# EAGLE design touch_7 (EAGLE 9.6.2)
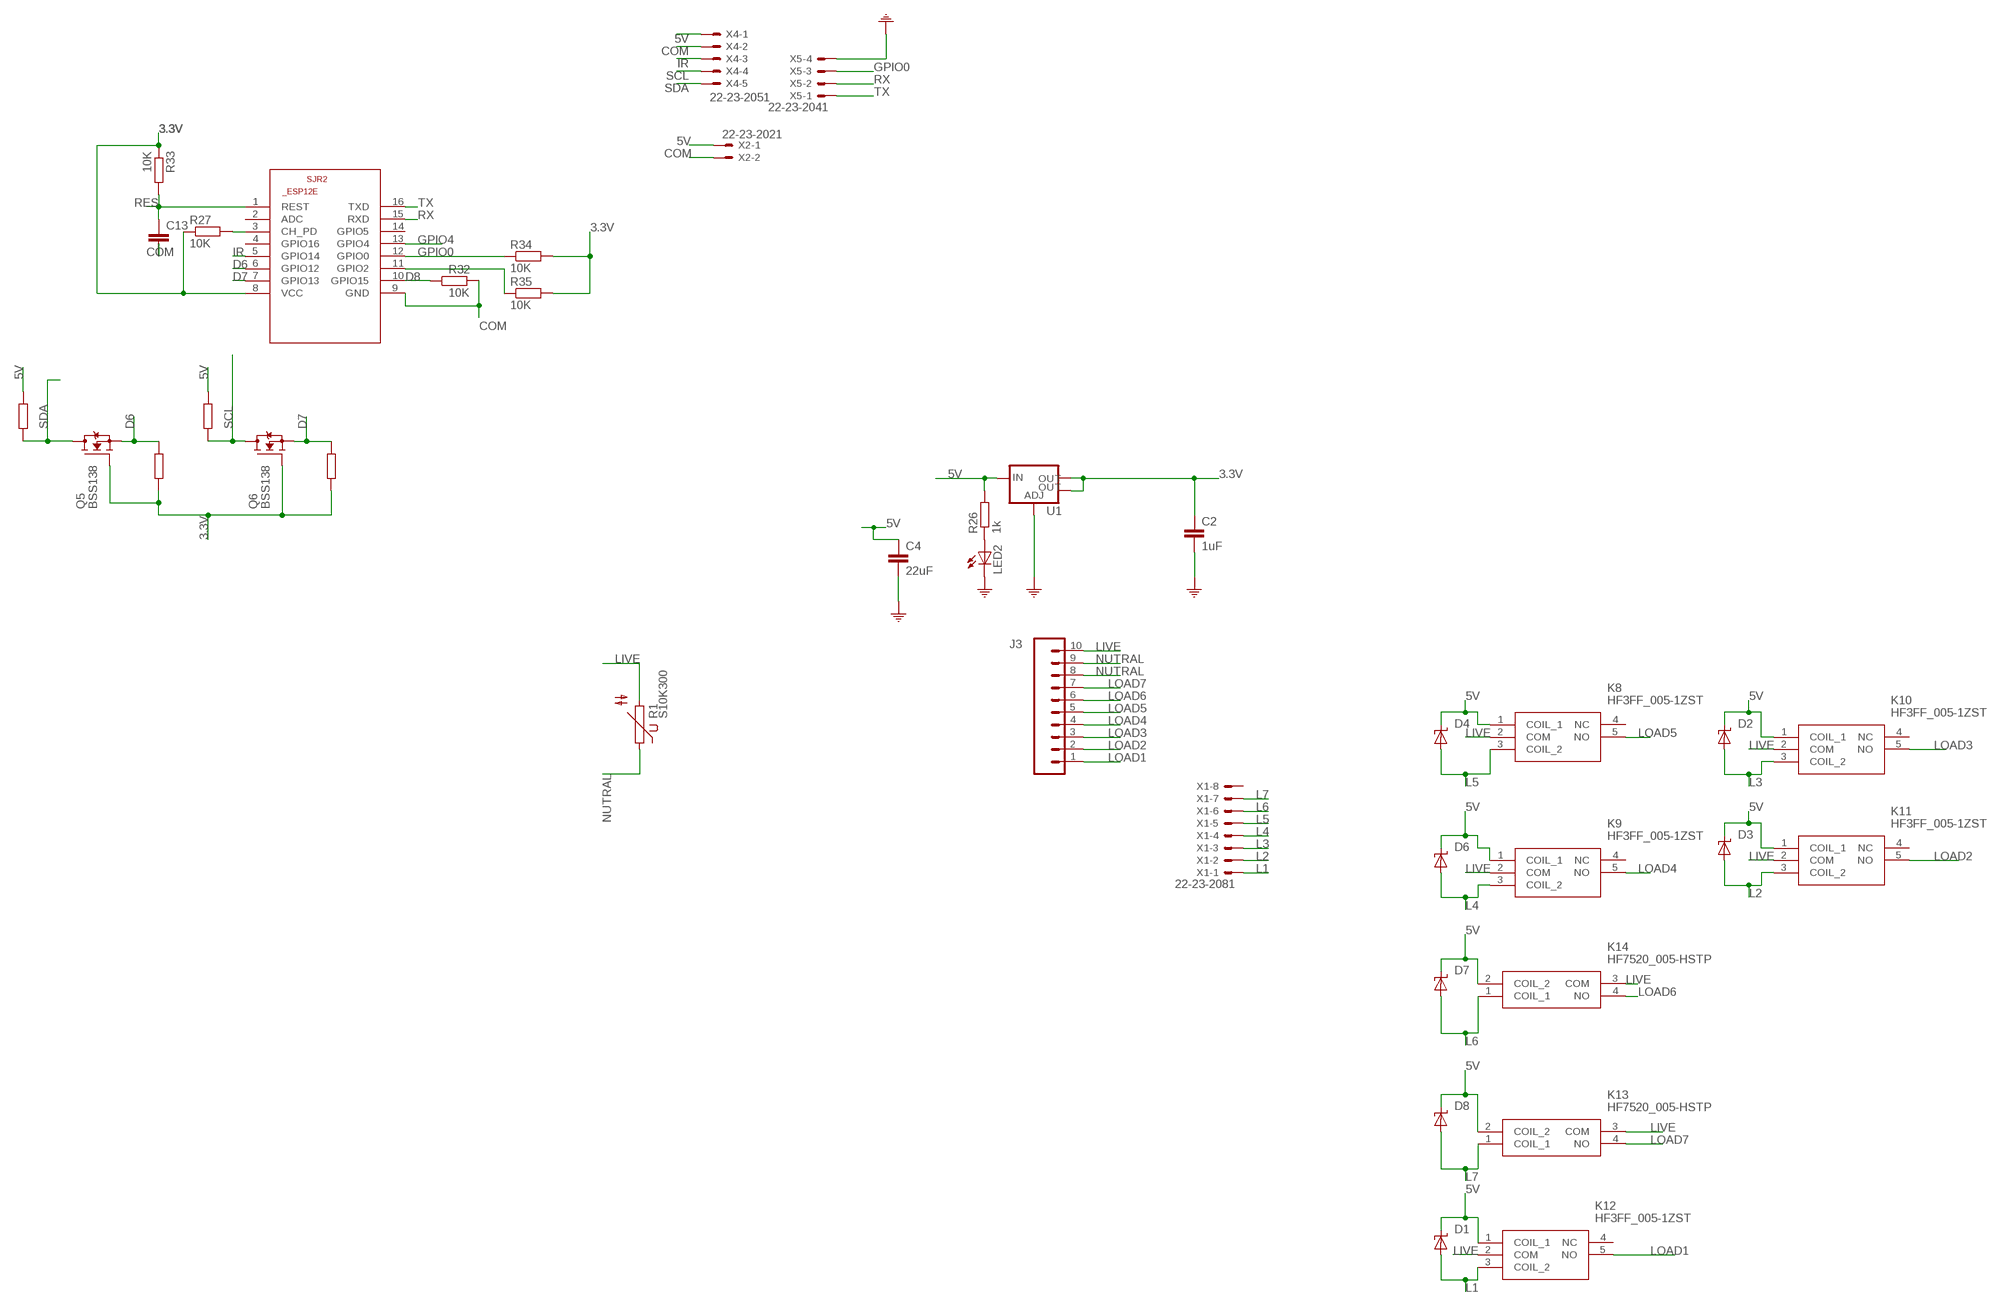
[diagram p0: schematic, sheet 1]

## Parts
C2  1uF  C-EUC1206  [C1206]
C4  22uF  C-EUC1206  [C1206]
C13  C-EUC0805  [C0805]
D1  SUPPRESSOR-SMBJ  [SMBJ]
D2  SUPPRESSOR-SMBJ  [SMBJ]
D3  SUPPRESSOR-SMBJ  [SMBJ]
D4  SUPPRESSOR-SMBJ  [SMBJ]
D6  SUPPRESSOR-SMBJ  [SMBJ]
D7  SUPPRESSOR-SMBJ  [SMBJ]
D8  SUPPRESSOR-SMBJ  [SMBJ]
J3  CONN_083.5MM-8  [SCREWTERMINAL-3.5MM-8]
K8  HF3FF_005-1ZST  [HF3FF0051ZST]
K9  HF3FF_005-1ZST  [HF3FF0051ZST]
K10  HF3FF_005-1ZST  [HF3FF0051ZST]
K11  HF3FF_005-1ZST  [HF3FF0051ZST]
K12  HF3FF_005-1ZST  [HF3FF0051ZST]
K13  HF7520_005-HSTP  [HF7520005HSTP]
K14  HF7520_005-HSTP  [HF7520005HSTP]
LED2  LEDCHIPLED_1206  [CHIPLED_1206]
Q5  BSS138  [SOT23]
Q6  BSS138  [SOT23]
R1  S10K300  [S10K300]
R26  1k  R-EU_R0805  [R0805]
R27  10K  R-EU_R0805  [R0805]
R32  10K  R-EU_R0805  [R0805]
R33  10K  R-EU_R0805  [R0805]
R34  10K  R-EU_R0805  [R0805]
R35  10K  R-EU_R0805  [R0805]
R36  10K  R-EU_R0805  [R0805]
R37  10K  R-EU_R0805  [R0805]
R38  10K  R-EU_R0805  [R0805]
R39  10K  R-EU_R0805  [R0805]
SJR2  ESP8266-12EESP12E  [ESP8266-ESP12E]
U1  V_REG_LM1117SOT223  [SOT223]
X1  22-23-2081  [22-23-2081]
X2  22-23-2021  [22-23-2021]
X4  22-23-2051  [22-23-2051]
X5  22-23-2041  [22-23-2041]

## Nets
3.3V: C2.1 Q5.1(G) Q6.1(G) R27.1 R33.1 R34.2 R35.2 R37.2 R39.2 SJR2.8(VCC) U1.2(OUT) U1.4(OUT)
5V: C4.1 D1.C D2.C D3.C D4.C D6.C D7.C D8.C K8.1(COIL_1) K9.1(COIL_1) K10.1(COIL_1) K11.1(COIL_1) K12.1(COIL_1) K13.2(COIL_2) K14.2(COIL_2) R26.2 R36.2 R38.2 U1.3(IN) X2.1 X4.1
COM: C2.2 C4.2 C13.2 LED2.C R32.2 SJR2.9(GND) U1.1(ADJ) X2.2 X4.2 X5.4
D6: Q5.2(S) R37.1 SJR2.6(GPIO12)
D7: Q6.2(S) R39.1 SJR2.7(GPIO13)
D8: R32.1 SJR2.10(GPIO15)
GPIO0: R34.1 SJR2.12(GPIO0) X5.3
GPIO4: SJR2.13(GPIO4)
IR: SJR2.5(GPIO14) X4.3
L1: D1.A K12.3(COIL_2) X1.1
L2: D3.A K11.3(COIL_2) X1.2
L3: D2.A K10.3(COIL_2) X1.3
L4: D6.A K9.3(COIL_2) X1.4
L5: D4.A K8.3(COIL_2) X1.5
L6: D7.A K14.1(COIL_1) X1.6
L7: D8.A K13.1(COIL_1) X1.7
LIVE: J3.10 K8.2(COM) K9.2(COM) K10.2(COM) K11.2(COM) K12.2(COM) K13.3(COM) K14.3(COM) R1.2
LOAD1: J3.1 K12.5(NO)
LOAD2: J3.2 K11.5(NO)
LOAD3: J3.3 K10.5(NO)
LOAD4: J3.4 K9.5(NO)
LOAD5: J3.5 K8.5(NO)
LOAD6: J3.6 K14.4(NO)
LOAD7: J3.7 K13.4(NO)
N$13: LED2.A R26.1
N$23: R35.1 SJR2.11(GPIO2)
N$27: R27.2 SJR2.3(CH_PD)
NUTRAL: J3.8 J3.9 R1.1
RES: C13.1 R33.2 SJR2.1(REST)
RX: SJR2.15(RXD) X5.2
SCL: Q6.3(D) R36.1 X4.4
SDA: Q5.3(D) R38.1 X4.5
TX: SJR2.16(TXD) X5.1
Unconnected: K8.4(NC) K9.4(NC) K10.4(NC) K11.4(NC) K12.4(NC) SJR2.2(ADC) SJR2.4(GPIO16) SJR2.14(GPIO5) X1.8

## Library data of the parts
C2 C4 C13 = rcl:C-EU: CAPACITOR, European symbol
D1-D4 D6-D8 = _mod_diode:SUPPRESSOR-: Suppressor diode
J3 = SparkFun-Connectors SMD_ 10_Screw:CONN_08: Multi connection point. Often used as Generic Header-pin footprint for 0.1 inch spaced/style header connections On any of the 0.1 inch spaced packages, you can populate with these: Break Away Headers - Straight <https://www.sparkfun.com/products/116> (PRT-00116) Break Away Male Headers - Right Angle <https://www.sparkfun.com/products/553> (PRT-00553) Female Headers <https://www.sparkfun.com/products/115> (PRT-00115) Break Away Headers - Machine Pin <https://www.sparkfun.com/products/117> (PRT-00117) Break Away Female Headers - Swiss Machine Pin <https://www.sparkfun.com/products/743> (PRT-00743) Arduino Stackable Header - 8 Pin <https://www.sparkfun.com/products/9279> (PRT-09279) For SCREWTERMINALS and SPRING TERMINALS visit here: Screw Terimnals on SparkFun.com <https://www.sparkfun.com/search/results?term=Screw+Terminals> (5mm/3.5mm/2.54mm spacing) This device is also useful as a general connection point to wire up your design to another part of your project. Our various solder wires solder well into these plated through hole pads. Hook-Up Wire - Assortment (Stranded, 22 AWG) <https://www.sparkfun.com/products/11375> (PRT-11375) Hook-Up Wire - Assortment (Solid Core, 22 AWG) <https://www.sparkfun.com/products/11367> (PRT-11367) View the entire wire category on our website here <https://www.sparkfun.com/categories/141> Special notes: Molex polarized connector foot print use with SKU : PRT-08231 with associated crimp pins and housings. 1MM SMD Version SKU: PRT-10208 NOTES ON THE VARIANTS LOCK and LOCK_LONGPADS... This footprint was designed to help hold the alignment of a through-hole component (i.e. 6-pin header) while soldering it into place. You may notice that each hole has been shifted either up or down by 0.005 of an inch from it's more standard position (which is a perfectly straight line). This slight alteration caused the pins (the squares in the middle) to touch the edges of the holes. Because they are alternating, it causes a "brace" to hold the component in place. 0.005 has proven to be the perfect amount of "off-center" position when using our standard breakaway headers. Although looks a little odd when you look at the bare footprint, once you have a header in there, the alteration is very hard to notice. Also,if you push a header all the way into place, it is covered up entirely on the bottom side.
K8-K12 = HF3FF_005-1ZST:HF3FF_005-1ZST: SUBMINATURE HIGH POWER RELAY Source: Datasheet <http://www.hongfa.com/pro/pdf/HF3FF_en.pdf>; ARROW_PART_NUMBER: HF3FF/005-1ZST; DESCRIPTION: SUBMINATURE HIGH POWER RELAY; HEIGHT: 15mm; MANUFACTURER_NAME: Hongfa; MANUFACTURER_PART_NUMBER: HF3FF/005-1ZST
K13 K14 = HF7520_005-HSTP:HF7520_005-HSTP: Subminiature Power Relay, 1-Form-A, PCB Source: Datasheet <http://www.hongfa.com:8080/pdfjs/web/viewer.html?file=/Uploads/PDF/HF7520_en.pdf&stamp=1564134997314>; ARROW_PART_NUMBER: HF7520/005-HSTP; DESCRIPTION: Subminiature Power Relay, 1-Form-A, PCB; HEIGHT: 11.4mm; MANUFACTURER_NAME: Hongfa; MANUFACTURER_PART_NUMBER: HF7520/005-HSTP
LED2 = led:LED: LED OSRAM: - CHIPLED LG R971, LG N971, LY N971, LG Q971, LY Q971, LO R971, LY R971 LH N974, LH R974 LS Q976, LO Q976, LY Q976 LO Q996 - Hyper CHIPLED LW Q18S LB Q993, LB Q99A, LB R99A - SideLED LS A670, LO A670, LY A670, LG A670, LP A670 LB A673, LV A673, LT A673, LW A673 LH A674 LY A675 LS A676, LA A676, LO A676, LY A676, LW A676 LS A679, LY A679, LG A679 - Hyper Micro SIDELED® LS Y876, LA Y876, LO Y876, LY Y876 LT Y87S - SmartLED LW L88C, LW L88S LB L89C, LB L89S, LG L890 LS L89K, LO L89K, LY L89K LS L896, LA L896, LO L896, LY L896 - TOPLED LS T670, LO T670, LY T670, LG T670, LP T670 LSG T670, LSP T670, LSY T670, LOP T670, LYG T670 LG T671, LOG T671, LSG T671 LB T673, LV T673, LT T673, LW T673 LH T674 LS T676, LA T676, LO T676, LY T676, LB T676, LH T676, LSB T676, LW T676 LB T67C, LV T67C, LT T67C, LS T67K, LO T67K, LY T67K, LW E67C LS E67B, LA E67B, LO E67B, LY E67B, LB E67C, LV E67C, LT E67C LW T67C LS T679, LY T679, LG T679 LS T770, LO T770, LY T770, LG T770, LP T770 LB T773, LV T773, LT T773, LW T773 LH T774 LS E675, LA E675, LY E675, LS T675 LS T776, LA T776, LO T776, LY T776, LB T776 LHGB T686 LT T68C, LB T68C - Hyper Mini TOPLED® LB M676 - Mini TOPLED Santana® LG M470 LS M47K, LO M47K, LY M47K Source: http://www.osram.convergy.de LUXEON: - LUMILED® LXK2-PW12-R00, LXK2-PW12-S00, LXK2-PW14-U00, LXK2-PW14-V00 LXK2-PM12-R00, LXK2-PM12-S00, LXK2-PM14-U00 LXK2-PE12-Q00, LXK2-PE12-R00, LXK2-PE12-S00, LXK2-PE14-T00, LXK2-PE14-U00 LXK2-PB12-K00, LXK2-PB12-L00, LXK2-PB12-M00, LXK2-PB14-N00, LXK2-PB14-P00, LXK2-PB14-Q00 LXK2-PR12-L00, LXK2-PR12-M00, LXK2-PR14-Q00, LXK2-PR14-R00 LXK2-PD12-Q00, LXK2-PD12-R00, LXK2-PD12-S00 LXK2-PH12-R00, LXK2-PH12-S00 LXK2-PL12-P00, LXK2-PL12-Q00, LXK2-PL12-R00 Source: www.luxeon.com KINGBRIGHT: KA-3528ASYC Source: www.kingbright.com
Q5 Q6 = bss138_10:BSS138: BSS138 N-Channel Logic Level Enhancement Mode Field Effect Transistor Source: http://www.fairchildsemi.com/datasheets/BS/BSS138.pdf; MF: Fairchild; MPN: BSS138; OC_FARNELL: 9845330; OC_NEWARK: 67R2009
R1 = varistor:S10K300: VARISTOR
R26 R27 R32-R39 = resistor:R-EU_: RESISTOR, European symbol
SJR2 = esp12e:ESP8266-12E: ESP8266-12E Library for Eagle CAD The author not responsible for any damages or errors!. Created by Suhail jr.lt;/author>
U1 = SparkFun-IC-Power:V_REG_LM1117: Voltage Regulator LM1117 Standard adjustable voltage regulator but in SMD form. Spark Fun Electronics SKU : COM-00595; PROD_ID: VREG-08170
X1 = con-molex-new white color :22-23-2081: .100" (2.54mm) Center Header - 8 Pin
X2 = con-molex-new white color :22-23-2021: .100" (2.54mm) Center Header - 2 Pin
X4 = con-molex-new white color :22-23-2051: .100" (2.54mm) Center Header - 5 Pin
X5 = con-molex-new white color :22-23-2041: .100" (2.54mm) Center Header - 4 Pin

## Board
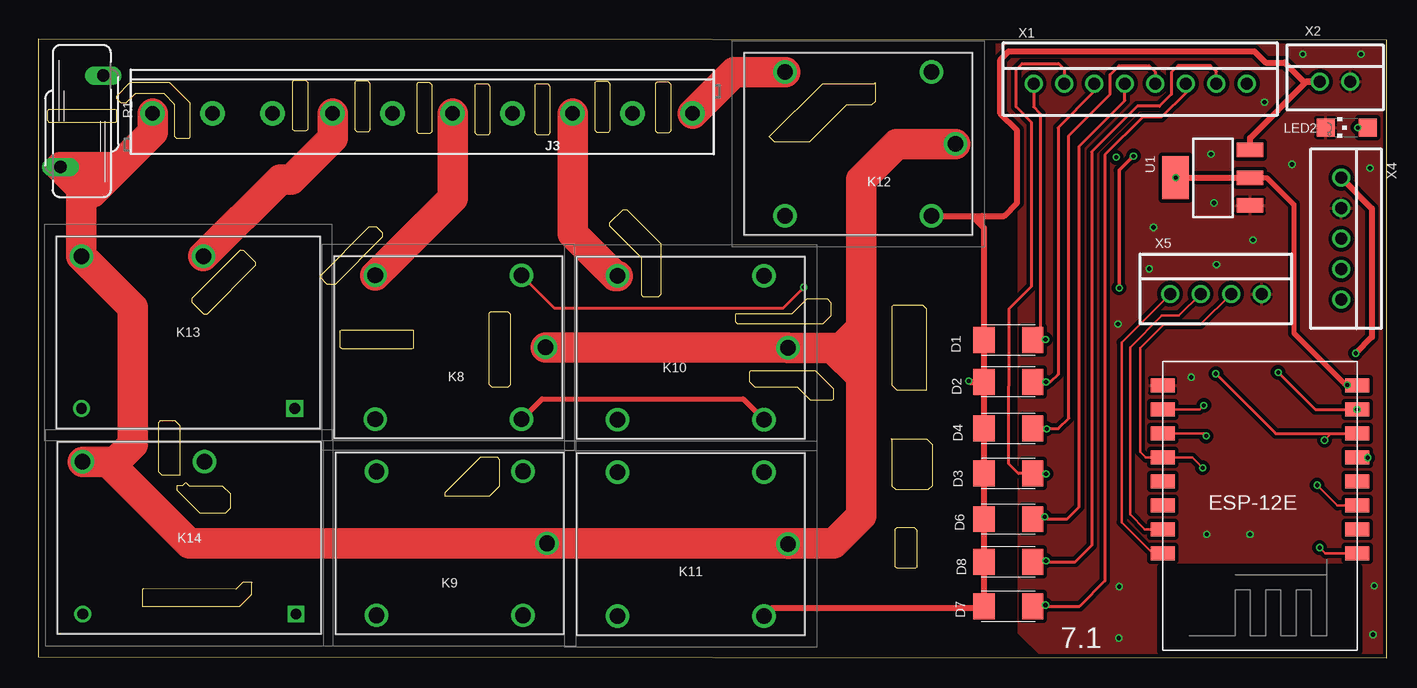
[diagram p1: board, top side]
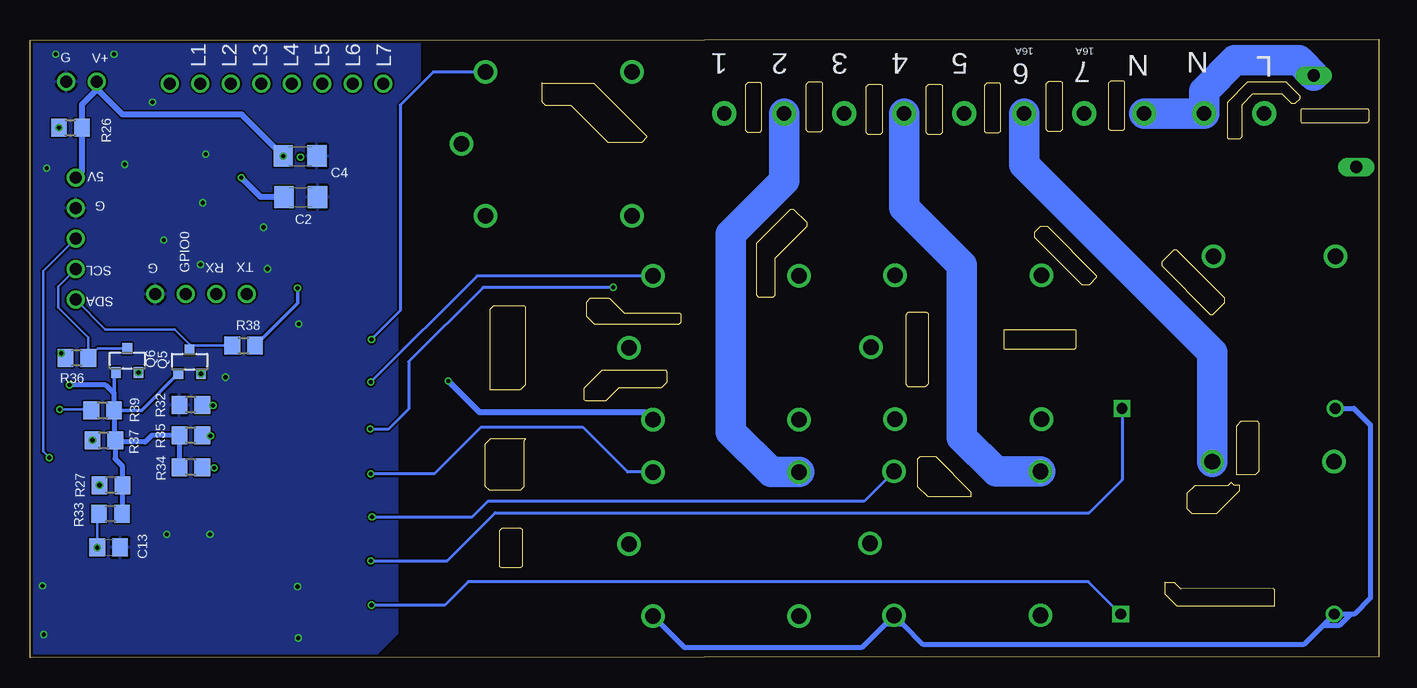
[diagram p2: board, bottom side, seen from below]

Size 112.4 x 51.6 mm. Coordinates in mm from the lower left corner, seen from the top.
Outline: 112.4,51.5 0,51.6 0,0.1 112.4,0 112.4,51.5
Outline: 0.9,45.75 6.45,45.75 6.5,45.7 6.5,44.7 6.45,44.65 0.95,44.65 0.8,44.8 0.8,45.65 0.9,45.75
Outline: 6.55,46.85 7.7,48 10.95,48 12.65,46.3 12.65,43.4 12.55,43.3 11.55,43.3 11.4,43.45 11.4,46.15 10.5,47.05 8.1,47.05 7.3,46.25 6.95,46.25 6.55,46.65 6.55,46.85
Outline: 21.2,48.05 21.2,44.1 21.35,43.95 22.35,43.95 22.5,44.1 22.5,47.95 22.3,48.15 21.3,48.15 21.2,48.05
Outline: 26.4,48 26.4,44.05 26.55,43.9 27.55,43.9 27.7,44.05 27.7,47.9 27.5,48.1 26.5,48.1 26.4,48
Outline: 31.55,47.85 31.55,43.9 31.7,43.75 32.7,43.75 32.85,43.9 32.85,47.75 32.65,47.95 31.65,47.95 31.55,47.85
Outline: 36.4,47.75 36.4,43.8 36.55,43.65 37.55,43.65 37.7,43.8 37.7,47.65 37.5,47.85 36.5,47.85 36.4,47.75
Outline: 41.4,47.75 41.4,43.8 41.55,43.65 42.55,43.65 42.7,43.8 42.7,47.65 42.5,47.85 41.5,47.85 41.4,47.75
Outline: 46.4,47.95 46.4,44 46.55,43.85 47.55,43.85 47.7,44 47.7,47.85 47.5,48.05 46.5,48.05 46.4,47.95
Outline: 51.45,47.9 51.45,43.95 51.6,43.8 52.6,43.8 52.75,43.95 52.75,47.8 52.55,48 51.55,48 51.45,47.9
Outline: 12.85,30 16.85,34 17.1,34 18.1,33 18.1,32.7 14.05,28.65 13.85,28.65 12.85,29.65 12.85,30
Outline: 23.5,31.85 27.6,35.95 28.2,35.95 28.7,35.45 28.7,35.1 24.75,31.15 24.1,31.15 23.5,31.75 23.5,31.85
Outline: 49.05,37.4 51.9,34.55 51.9,30.3 51.7,30.1 50.45,30.1 50.3,30.25 50.3,33.35 47.65,36 47.65,36.3 48.75,37.4 49.05,37.4
Outline: 58.2,28.7 62.85,28.7 64.1,29.95 65.75,29.95 66.05,29.65 66.05,28.5 65.4,27.85 58.3,27.85 58.15,28 58.15,28.65 58.2,28.7
Outline: 59.4,23.95 64.75,23.95 66.25,22.45 66.25,21.55 66.15,21.45 64.4,21.45 63.3,22.55 59.75,22.55 59.3,23 59.3,23.85 59.4,23.95
Outline: 10,19.6 10,15.55 10.3,15.25 11.85,15.25 11.85,19.35 11.45,19.75 10.15,19.75 10,19.6
Outline: 71.15,29.3 71.15,22.75 71.55,22.35 74.05,22.35 74.05,29.1 73.75,29.4 71.25,29.4 71.15,29.3
Outline: 71.1,18.25 74.05,18.25 74.5,17.8 74.5,14.35 74.15,14 71.5,14 71.2,14.3 71.2,18.15 71.1,18.25
Outline: 25.2,27.3 25.25,27.35 31.25,27.35 31.25,25.8 31.2,25.75 25.35,25.75 25.2,25.9 25.2,27.3
Outline: 8.75,5.75 8.8,5.8 16.5,5.75 17.05,6.3 17.85,6.3 17.8,6.25 17.8,5.3 16.8,4.3 8.7,4.3 8.7,5.7 8.75,5.75
Outline: 37.55,28.7 37.55,22.85 37.8,22.6 39.2,22.6 39.4,22.8 39.4,28.65 39.2,28.85 37.7,28.85 37.55,28.7
Outline: 12.3,14.65 12.6,14.35 15.35,14.35 16,13.7 16,12.45 15.6,12.05 13.5,12.05 11.6,13.95 11.6,14.4 12.05,14.4 12.3,14.65
Outline: 33.95,13.8 36.9,16.75 38.25,16.75 38.45,16.55 38.45,14.3 37.6,13.45 33.95,13.45 33.95,13.8
Outline: 60.95,43.45 65.4,47.9 69.7,47.9 69.75,47.95 69.75,46.4 69.45,46.1 67.35,46.1 64.25,43 61.4,43 60.95,43.45
Outline: 71.55,10.85 71.4,10.7 71.4,7.65 71.55,7.5 73.15,7.5 73.25,7.6 73.25,10.65 73.05,10.85 71.55,10.85
Copper layers (1*16): Top 0.018mm / dielectric 1.55mm / Bottom 0.018mm
Design rules "eC_2Layer_PClass6_BaseCopperO18_eCDefault *": minimum track width 0.15mm, minimum drill 0.3mm, track to track 0.15mm, track to pad 0.15mm, pad to pad 0.15mm, via to via 0.15mm, smd to smd 0mil, copper to edge 0.25mm, drill to drill 0.35mm, minimum pad ring 0.175mm, minimum via ring 0.125mm, stop-mask expansion 0mil, vias tented up to drill 0.35mm, thermal gap 0.2mm

### Footprints (pad centres in the part's own frame; a part is rotated, then mirrored left to right if it is on the bottom)
C1206 = smd 1.6 x 1.8: 1 -1.4,0; 2 1.4,0
C0805 = smd 1.3 x 1.5: 1 -0.95,0; 2 0.95,0
SMBJ = smd 1.78 x 2.16: A 2.04,0; C -2.03,0
SCREWTERMINAL-3.5MM-8 = drill 1.2 pad 2.032: 1 0,0; 2 5,0; 3 10,0; 4 15,0; 5 20,0; 6 25,0; 7 30,0; 8 35,0; 9 40,0; 10 45,0
HF3FF0051ZST = drill 1.3 pad 1.95: 1 -6.1,6; 2 -8.1,0; 3 -6.1,-6; 4 6.1,6; 5 6.1,-6
HF7520005HSTP = drill 0.9 pad 1.4 square: 1 0,0 | drill 0.9 pad 1.4: 2 -17.78,0 | drill 1.3 pad 1.95: 3 -17.78,12.7; 4 -7.62,12.7
CHIPLED_1206 = smd 1.5 x 1.5: A 0,-1.75; C 0,1.75
SOT23 = smd 0.8 x 0.9: 1 -0.95,-1; 2 0.95,-1; 3 0,1
S10K300 = drill 1.016 long: 1 -1.778,-3.81; 2 1.778,3.81
R0805 = smd 1.3 x 1.5: 1 -0.95,0; 2 0.95,0
ESP8266-ESP12E = smd 2 x 1.2: 1 -7.62,5.84; 2 -7.62,3.84; 3 -7.62,1.84; 4 -7.62,-0.16; 5 -7.62,-2.16; 6 -7.62,-4.16; 7 -7.62,-6.16; 8 -7.62,-8.16; 9 8.58,-8.16; 10 8.58,-6.16; 11 8.58,-4.16; 12 8.58,-2.16; 13 8.58,-0.16; 14 8.58,1.84; 15 8.58,3.84; 16 8.58,5.84
SOT223 = smd 1.219 x 2.235: 1 -2.311,-3.099; 2 0,-3.099; 3 2.311,-3.099 | smd 3.6 x 2.2: 4 0,3.099
22-23-2081 = drill 1: 1 -8.89,0; 2 -6.35,0; 3 -3.81,0; 4 -1.27,0; 5 1.27,0; 6 3.81,0; 7 6.35,0; 8 8.89,0
22-23-2021 = drill 1: 1 -1.27,0; 2 1.27,0
22-23-2051 = drill 1: 1 -5.08,0; 2 -2.54,0; 3 0,0; 4 2.54,0; 5 5.08,0
22-23-2041 = drill 1: 1 -3.81,0; 2 -1.27,0; 3 1.27,0; 4 3.81,0

### Placement (x,y rotation side)
C2  89.84,38.43 0 bottom
C4  89.89,41.84 0 bottom
C13  105.85,9.2 0 bottom
D1  80.85,26.5 0 top
D2  80.85,23.02 0 top
D3  80.85,15.37 0 top
D4  80.85,19.12 0 top
D6  80.85,11.57 0 top
D7  80.85,4.31 0 top
D8  80.85,8.01 0 top
J3  54.55,45.4 180 top
K8  34.2,25.9 180 top
K9  34.3,9.55 180 top
K10  54.4,25.85 180 top
K11  54.4,9.5 180 top
K12  68.35,42.85 180 top
K13  21.4,20.8 0 top
K14  21.5,3.65 0 top
LED2  109.05,44.22 90 top
Q5  99.1,24.7 0 bottom
Q6  104.3,24.8 0 bottom
R1  3.65,44.75 180 top
R26  109.03,44.22 0 bottom
R27  105.65,14.4 180 bottom
R32  99,21.1 180 bottom
R33  105.7,12 180 bottom
R34  99,15.9 180 bottom
R35  99,18.55 180 bottom
R36  108.5,25 180 bottom
R37  106.25,18.15 0 bottom
R38  94.6,26.05 0 bottom
R39  106.35,20.65 0 bottom
SJR2  102.3,14.55 180 top
U1  97.9,40.04 90 top
X1  91.85,47.9 0 top
X2  108.1,48.05 0 top
X4  108.6,34.95 270 top
X5  98.15,30.35 0 top

### Tracks (layer width: path | path; a pad name or v marks a point on that pad's centre or on a via)
3.3V  (via drill 0.35)
  Top 0.406: v109.1,22.75 109.88,22.75 SJR2.8 109.02,22.71 104.65,27.08 104.65,37.8 102.41,40.04 U1.2
  Top 0.508: U1.4 U1.2
  Bottom 0.305: Q6.1 105.4,23.65 R39.2 103.1,20.65 Q5.1
  Bottom 0.406: R34.2 R35.2 102.25,18.55 102.8,18 105.15,18 R37.2 | R37.2 105.4,18.25 R39.2 105.4,22.05 106.1,22.75 v109.1,22.75 | R33.1 104.7,12.05 R27.1 104.7,16 105.3,16.6 R37.2
  Bottom 0.508: C2.1 93.19,38.43 U1.4
  other vias: 94.8,40.04
5V  (via drill 0.35)
  Top 0.305: C4.1 90.1,40.66 v90.1,30.85
  Top 0.406: K8.1 42,21.6 58.75,21.6 K10.1
  Top 0.508: D2.C D1.C 78.82,35.88 78.55,36.15 | D2.C D4.C D3.C D6.C D8.C D7.C 78.66,4.15 61.15,4.15 K11.1 | 78.55,36.15 77.85,36.85 K12.1 78.65,36.85 | v77.55,23.1 77.63,23.02 D2.C | U1.3 101,43.35 105.71,48.05 X2.1 105.48,48.05 103.88,49.65 102.31,49.65 101.37,50.58 80.88,50.58 80.2,49.9 80.2,45.4 81.6,44 81.6,37.95 80.5,36.85 78.65,36.85 | X4.1 111.15,37.48 111.15,26.75 v109.8,25.4 | 78.55,36.15 78.65,36.25 78.65,36.85
  Bottom 0.305: v90.1,30.85 90.1,29.6 R38.2
  Bottom 0.406: K13.2 2.07,20.8 0.7,19.43 0.7,5 2.05,3.65 2.35,3.65 | 2.35,3.65 K14.2 4.69,2.69 | 4.69,2.69 6.27,1.1 37.95,1.1 39.65,2.8 | 39.65,2.8 K9.1 41.1,2.85 | 41.1,2.85 43.1,0.85 57.85,0.85 K11.1 | 39.65,2.8 41.05,2.8 41.1,2.85 | 2.35,3.65 3.31,2.69 4.69,2.69
  Bottom 0.508: K10.1 61.15,20.5 74.95,20.5 v77.55,23.1 | X4.1 108.08,40.55 R26.2 108.08,46.15 106.83,47.4 X2.1 106.83,47.45 104.68,45.3 94.74,45.3 C4.1 | v109.8,25.4 109.8,25.35 R36.2
  other vias: 91.29,41.84
COM  (via drill 0.35)
  other vias: 90,27.85 92.6,32.45 92.95,35.9 98.2,32.8 96.1,23.4 90.05,1.65 90.1,5.95 97.4,10.3 101,10.3 111.35,6 111.25,1.95 101.25,34.85 98,37.95 97.75,42 104.5,41.15 111,40.85 110.25,50.35 105.4,50.35 102.2,46.35
  pour Top (isolate 0.305): 80.5,51.5 112.4,51.5 112.4,0.05 112.35,0 83.75,0 81.7,2.05 81.7,44.5 79.85,46.35 79.85,51.35 80,51.5
  pour Bottom: 80,51.5 112.4,51.5 112.4,0.1 112.3,0 83.75,0 81.7,2.05 81.7,44.3 79.85,46.15 79.85,51.35
D6  (via drill 0.35)
  Top 0.203: SJR2.6 107.76,18.71 R37.1
  Top 0.254: Q5.2 103.14,18.71 SJR2.6
  other vias: 107.2,18.15 98.15,23.7
D7  (via drill 0.35)
  Top 0.254: Q6.2 106.44,20.71 SJR2.7
  Bottom 0.203: R39.1 107.36,20.71 SJR2.7
  other vias: 109.92,20.71 103.35,23.8
D8  (via drill 0.35)
  Top 0.203: SJR2.10 96.81,20.71 v97.15,21.05
  Bottom 0.203: v97.15,21.05 98,21.05 R32.1
GPIO0  (via drill 0.35)
  Top 0.203: X5.3 96.87,27.8 93.8,27.8 91.85,25.85 91.85,17.18 92.32,16.71 SJR2.12 96.19,16.71 v97.05,15.85
  Bottom 0.203: v97.05,15.85 97.1,15.9 R34.1
IR  (via drill 0.35)
  Top 0.203: v110.8,16.7 SJR2.5
  Bottom 0.203: X4.3 111.3,32.25 111.3,17.2 v110.8,16.7
L1  (via drill 0.35)
  Top 0.254: v83.95,26.55 83.9,26.5 D1.A 83.54,27.15 83.54,45.37 82.96,45.95 X1.1
  Bottom 0.254: K12.3 78.8,48.85 81.55,46.1 81.55,28.95 v83.95,26.55
L2  (via drill 0.35)
  Top 0.254: v84,15.35 82.91,15.35 D3.A 81.69,15.37 80.9,16.16 80.95,29.15 82.8,31 82.8,44.65 81.5,45.95 81.5,49.05 82,49.55 85.05,49.55 85.5,49.1 X1.2
  Bottom 0.254: K11.3 62.6,15.5 66.35,19.25 74.8,19.25 78.7,15.35 v84,15.35
L3  (via drill 0.35)
  Top 0.254: D2.A 82.91,23 v84,23 84.35,23 85,23.65 85,44.21 88.04,47.25 X1.3
  Bottom 0.254: v84,23 75.15,31.85 K10.3
L4  (via drill 0.35)
  Top 0.254: v83.9,11.75 83.72,11.57 D6.A 85.75,11.57 86.75,12.57 86.75,42.65 90.58,46.48 X1.4
  Bottom 0.254: K9.3 42.9,13.05 74.25,13.05 75.55,11.75 v83.9,11.75
L5  (via drill 0.35)
  Top 0.254: K8.3 43.05,29.15 62.05,29.15 v63.8,30.9 | v84.05,19.1 82.91,19.1 D4.A 85.04,19.12 85.9,19.98 85.9,43.55 89.35,47 89.35,48.65 90.1,49.4 92.6,49.4 93.12,48.88 X1.5
  Bottom 0.254: v63.8,30.9 74.65,30.9 80.85,24.7 80.85,20.75 82.5,19.1 v84.05,19.1
L6  (via drill 0.35)
  Top 0.254: v83.95,4.4 82.89,4.4 D7.A 86.8,4.31 88.9,6.4 88.9,41.95 92.05,45.1 93.6,45.1 95.66,47.1 X1.6
  Bottom 0.254: K14.1 24.2,6.35 75.9,6.35 77.85,4.4 v83.95,4.4
L7  (via drill 0.35)
  Top 0.254: v84,8.1 83.91,8.01 D8.A 86.44,8.01 87.8,9.37 87.8,42.2 91.6,46 93.45,46 94.45,47 94.45,48.85 95,49.4 97.7,49.4 98.2,48.9 X1.7
  Bottom 0.254: K13.1 21.4,14.85 24.15,12.1 73.65,12.1 77.65,8.1 v84,8.1
LIVE
  Top 2.54: 6.64,40.94 R1.2 3.62,39.19 | J3.10 9.55,43.85 6.64,40.94 | 3.62,39.19 K13.3 7.9,29.22 7.9,17.8 6.45,16.35 K14.3 5.82,16.35 12.62,9.55 K9.2 62.45,9.55 | 3.62,39.19 4.01,38.8 4.5,38.8 6.64,40.94 | 62.45,9.55 K11.2 | K8.2 62.45,25.9 K10.2 | K10.2 66.2,25.85 68.6,23.45 | 68.6,23.45 68.6,11.85 66.3,9.55 62.45,9.55 | 68.6,27.5 68.6,39.9 71.55,42.85 K12.2 | 68.6,27.5 66.95,25.85 K10.2 | 68.6,23.45 68.6,27.5
LOAD1
  Top 2.54: J3.1 58,48.85 K12.5
LOAD2
  Bottom 2.54: J3.2 49.55,39.8 54,35.35 54,26 54,18.85 50.65,15.5 K11.5
LOAD3
  Top 2.54: J3.3 44.55,35.4 48.1,31.85 K10.5
LOAD4
  Bottom 2.54: K9.5 31.9,15.55 34.75,18.4 34.75,32.75 39.55,37.55 J3.4
LOAD5
  Top 2.54: K8.5 34.55,38.35 J3.5
LOAD6
  Bottom 2.54: K14.4 13.88,25.48 29.55,41.15 J3.6
LOAD7
  Top 2.54: K13.4 20.18,39.9 21.1,39.9 24.55,43.35 J3.7
N$13  (via drill 0.35)
  Top 0.254: LED2.A R26.1
  other vias: 109.98,44.22
N$21  (via drill 0.35)
  other vias: 89.85,41.75
N$23  (via drill 0.35)
  Top 0.203: SJR2.11 97.14,18.71 v97.35,18.5
  Bottom 0.203: v97.35,18.5 97.4,18.55 R35.1
N$27  (via drill 0.35)
  Top 0.203: SJR2.3 108.29,12.71 R27.2
  other vias: 106.6,14.4
NUTRAL
  Bottom 2.54: R1.1 6.69,49.82 12,49.82 14.55,47.27 J3.9 J3.8
RES  (via drill 0.35)
  Top 0.203: SJR2.1 107.29,8.71 C13.1
  Bottom 0.203: R33.2 106.8,11.85 C13.1
  other vias: 106.8,9.2
RX
  Top 0.203: SJR2.15 92.24,10.71 91,11.95 91,25.9 93.65,28.55 95.08,28.55 X5.2
SCL
  Bottom 0.203: Q6.3 106.75,25.8 R36.1 107.55,26.7 110.05,29.2 110.05,30.96 X4.4
SDA
  Bottom 0.203: Q5.3 99.1,25.8 | 99.1,25.8 99.1,26.15 100.35,27.4 106.13,27.4 X4.5 | R38.1 98.85,26.05 99.1,25.8
TX
  Top 0.203: X5.1 90.3,26.31 90.3,11.3 92.89,8.71 SJR2.16

### Text on the board
bPlace: N | 16A | 16A | 5 | 4 | 3 | 2 | 1 | L | N | 7 | 6 | L7 | L6 | L5 | L4 | L3 | L2 | L1 | 5V | G | TX | RX | G | SCL | GPIO0 | SDA
tNames: 7.1
bNames: V+ | G